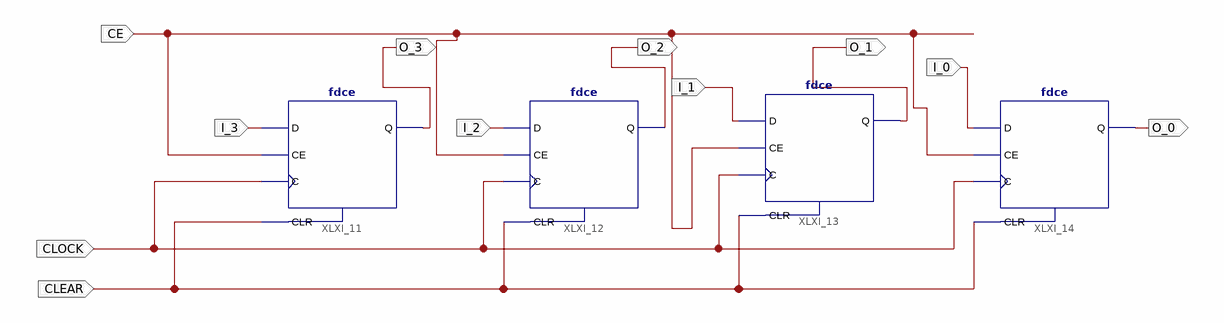
[diagram p0: schematic sheet 1]
// Xilinx ISE schematic Reg_4bit.sch (spartan3e) as structural Verilog: 4 symbols, 11 ports
module Reg_4bit (
  input  I_1,
  input  I_0,
  input  I_2,
  input  I_3,
  input  CLOCK,
  input  CLEAR,
  input  CE,
  output O_3,
  output O_2,
  output O_1,
  output O_0
);

  fdce XLXI_11 (.C(CLOCK), .CE(CE), .CLR(CLEAR), .D(I_3), .Q(O_3));
  fdce XLXI_12 (.C(CLOCK), .CE(CE), .CLR(CLEAR), .D(I_2), .Q(O_2));
  fdce XLXI_13 (.C(CLOCK), .CE(CE), .CLR(CLEAR), .D(I_1), .Q(O_1));
  fdce XLXI_14 (.C(CLOCK), .CE(CE), .CLR(CLEAR), .D(I_0), .Q(O_0));
endmodule
